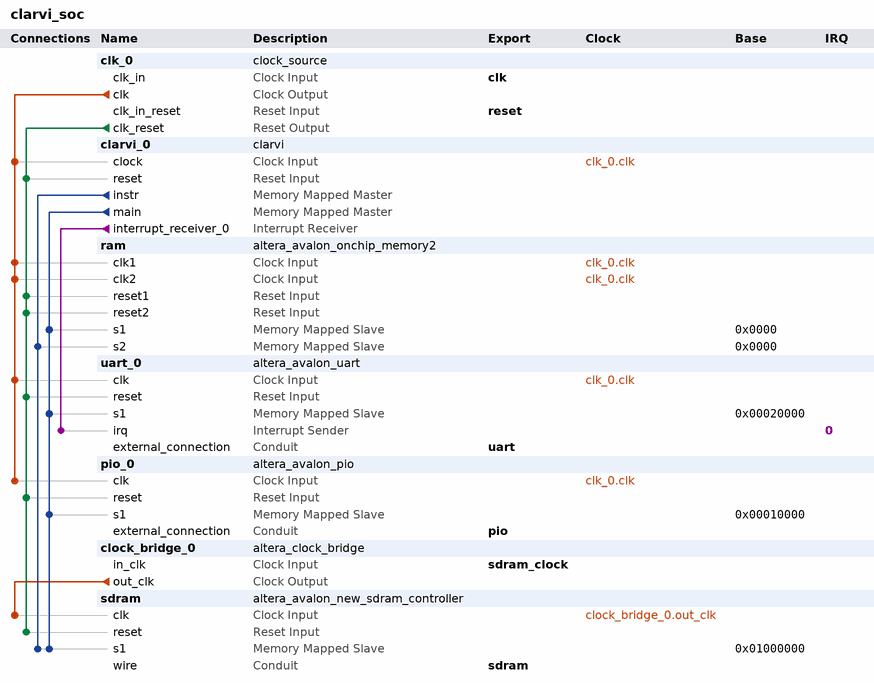
[diagram p0: system contents]
# Platform Designer (Qsys) system clarvi_soc, MAX 10 10M08SAU169C8G
# Parameters at their usual value, and those the tool derives, are not listed.
package require -exact qsys 18.1
create_system clarvi_soc
set_project_property DEVICE_FAMILY {MAX 10}
set_project_property DEVICE 10M08SAU169C8G

add_instance clk_0 clock_source 18.1
set_instance_parameter_value clk_0 clockFrequency 50000000

add_instance clarvi_0 clarvi 1.0
set_instance_parameter_value clarvi_0 DATA_ADDR_WIDTH 29
set_instance_parameter_value clarvi_0 DEFAULT_TRAP_VECTOR 0
set_instance_parameter_value clarvi_0 INITIAL_PC 0
set_instance_parameter_value clarvi_0 INSTR_ADDR_WIDTH 29

add_instance ram altera_avalon_onchip_memory2 18.1
set_instance_parameter_value ram dataWidth 32
set_instance_parameter_value ram dualPort true
set_instance_parameter_value ram initMemContent true
set_instance_parameter_value ram initializationFileName /home/vagrant/develop/riscv/clarvi/soc/mem.hex
set_instance_parameter_value ram memorySize 32768
set_instance_parameter_value ram useNonDefaultInitFile true

add_instance uart_0 altera_avalon_uart 18.1
set_instance_parameter_value uart_0 baud 115200
set_instance_parameter_value uart_0 dataBits 8
set_instance_parameter_value uart_0 fixedBaud false
set_instance_parameter_value uart_0 parity NONE
set_instance_parameter_value uart_0 stopBits 1

add_instance pio_0 altera_avalon_pio 18.1
set_instance_parameter_value pio_0 direction Output
set_instance_parameter_value pio_0 width 8

add_instance clock_bridge_0 altera_clock_bridge 18.1
set_instance_parameter_value clock_bridge_0 DERIVED_CLOCK_RATE 0
set_instance_parameter_value clock_bridge_0 EXPLICIT_CLOCK_RATE 100000000

add_instance sdram altera_avalon_new_sdram_controller 18.1
set_instance_parameter_value sdram TAC 5.4
set_instance_parameter_value sdram TRCD 15.0
set_instance_parameter_value sdram TRFC 65.0
set_instance_parameter_value sdram TRP 15.0
set_instance_parameter_value sdram TWR 16.0
set_instance_parameter_value sdram casLatency 3
set_instance_parameter_value sdram columnWidth 8
set_instance_parameter_value sdram dataWidth 16
set_instance_parameter_value sdram generateSimulationModel false
set_instance_parameter_value sdram initRefreshCommands 8
set_instance_parameter_value sdram model single_Micron_MT48LC4M32B2_7_chip
set_instance_parameter_value sdram numberOfBanks 4
set_instance_parameter_value sdram numberOfChipSelects 1
set_instance_parameter_value sdram powerUpDelay 200.0
set_instance_parameter_value sdram refreshPeriod 15.625
set_instance_parameter_value sdram rowWidth 12

# connections
add_connection clk_0.clk clarvi_0.clock clock
add_connection clk_0.clk pio_0.clk clock
add_connection clk_0.clk ram.clk1 clock
add_connection clk_0.clk ram.clk2 clock
add_connection clk_0.clk uart_0.clk clock
add_connection clock_bridge_0.out_clk sdram.clk clock
add_connection clk_0.clk_reset clarvi_0.reset reset
add_connection clk_0.clk_reset pio_0.reset reset
add_connection clk_0.clk_reset ram.reset1 reset
add_connection clk_0.clk_reset ram.reset2 reset
add_connection clk_0.clk_reset sdram.reset reset
add_connection clk_0.clk_reset uart_0.reset reset
add_connection clarvi_0.instr ram.s2 avalon
set_connection_parameter_value clarvi_0.instr/ram.s2 baseAddress 0x0000
add_connection clarvi_0.instr sdram.s1 avalon
set_connection_parameter_value clarvi_0.instr/sdram.s1 baseAddress 0x01000000
add_connection clarvi_0.main pio_0.s1 avalon
set_connection_parameter_value clarvi_0.main/pio_0.s1 baseAddress 0x00010000
add_connection clarvi_0.main ram.s1 avalon
set_connection_parameter_value clarvi_0.main/ram.s1 baseAddress 0x0000
add_connection clarvi_0.main sdram.s1 avalon
set_connection_parameter_value clarvi_0.main/sdram.s1 baseAddress 0x01000000
add_connection clarvi_0.main uart_0.s1 avalon
set_connection_parameter_value clarvi_0.main/uart_0.s1 baseAddress 0x00020000
add_connection clarvi_0.interrupt_receiver_0 uart_0.irq interrupt
set_connection_parameter_value clarvi_0.interrupt_receiver_0/uart_0.irq irqNumber 0

# exported interfaces
add_interface clk clock sink
set_interface_property clk EXPORT_OF clk_0.clk_in
add_interface pio conduit end
set_interface_property pio EXPORT_OF pio_0.external_connection
add_interface reset reset sink
set_interface_property reset EXPORT_OF clk_0.clk_in_reset
add_interface sdram conduit end
set_interface_property sdram EXPORT_OF sdram.wire
add_interface sdram_clock clock sink
set_interface_property sdram_clock EXPORT_OF clock_bridge_0.in_clk
add_interface uart conduit end
set_interface_property uart EXPORT_OF uart_0.external_connection

set_interconnect_requirement {$system} qsys_mm.clockCrossingAdapter HANDSHAKE
set_interconnect_requirement {$system} qsys_mm.enableEccProtection FALSE
set_interconnect_requirement {$system} qsys_mm.insertDefaultSlave FALSE
set_interconnect_requirement {$system} qsys_mm.maxAdditionalLatency 1

save_system clarvi_soc.qsys
